# Altium schematic sheet vme_bus_buff.SchDoc
size A3
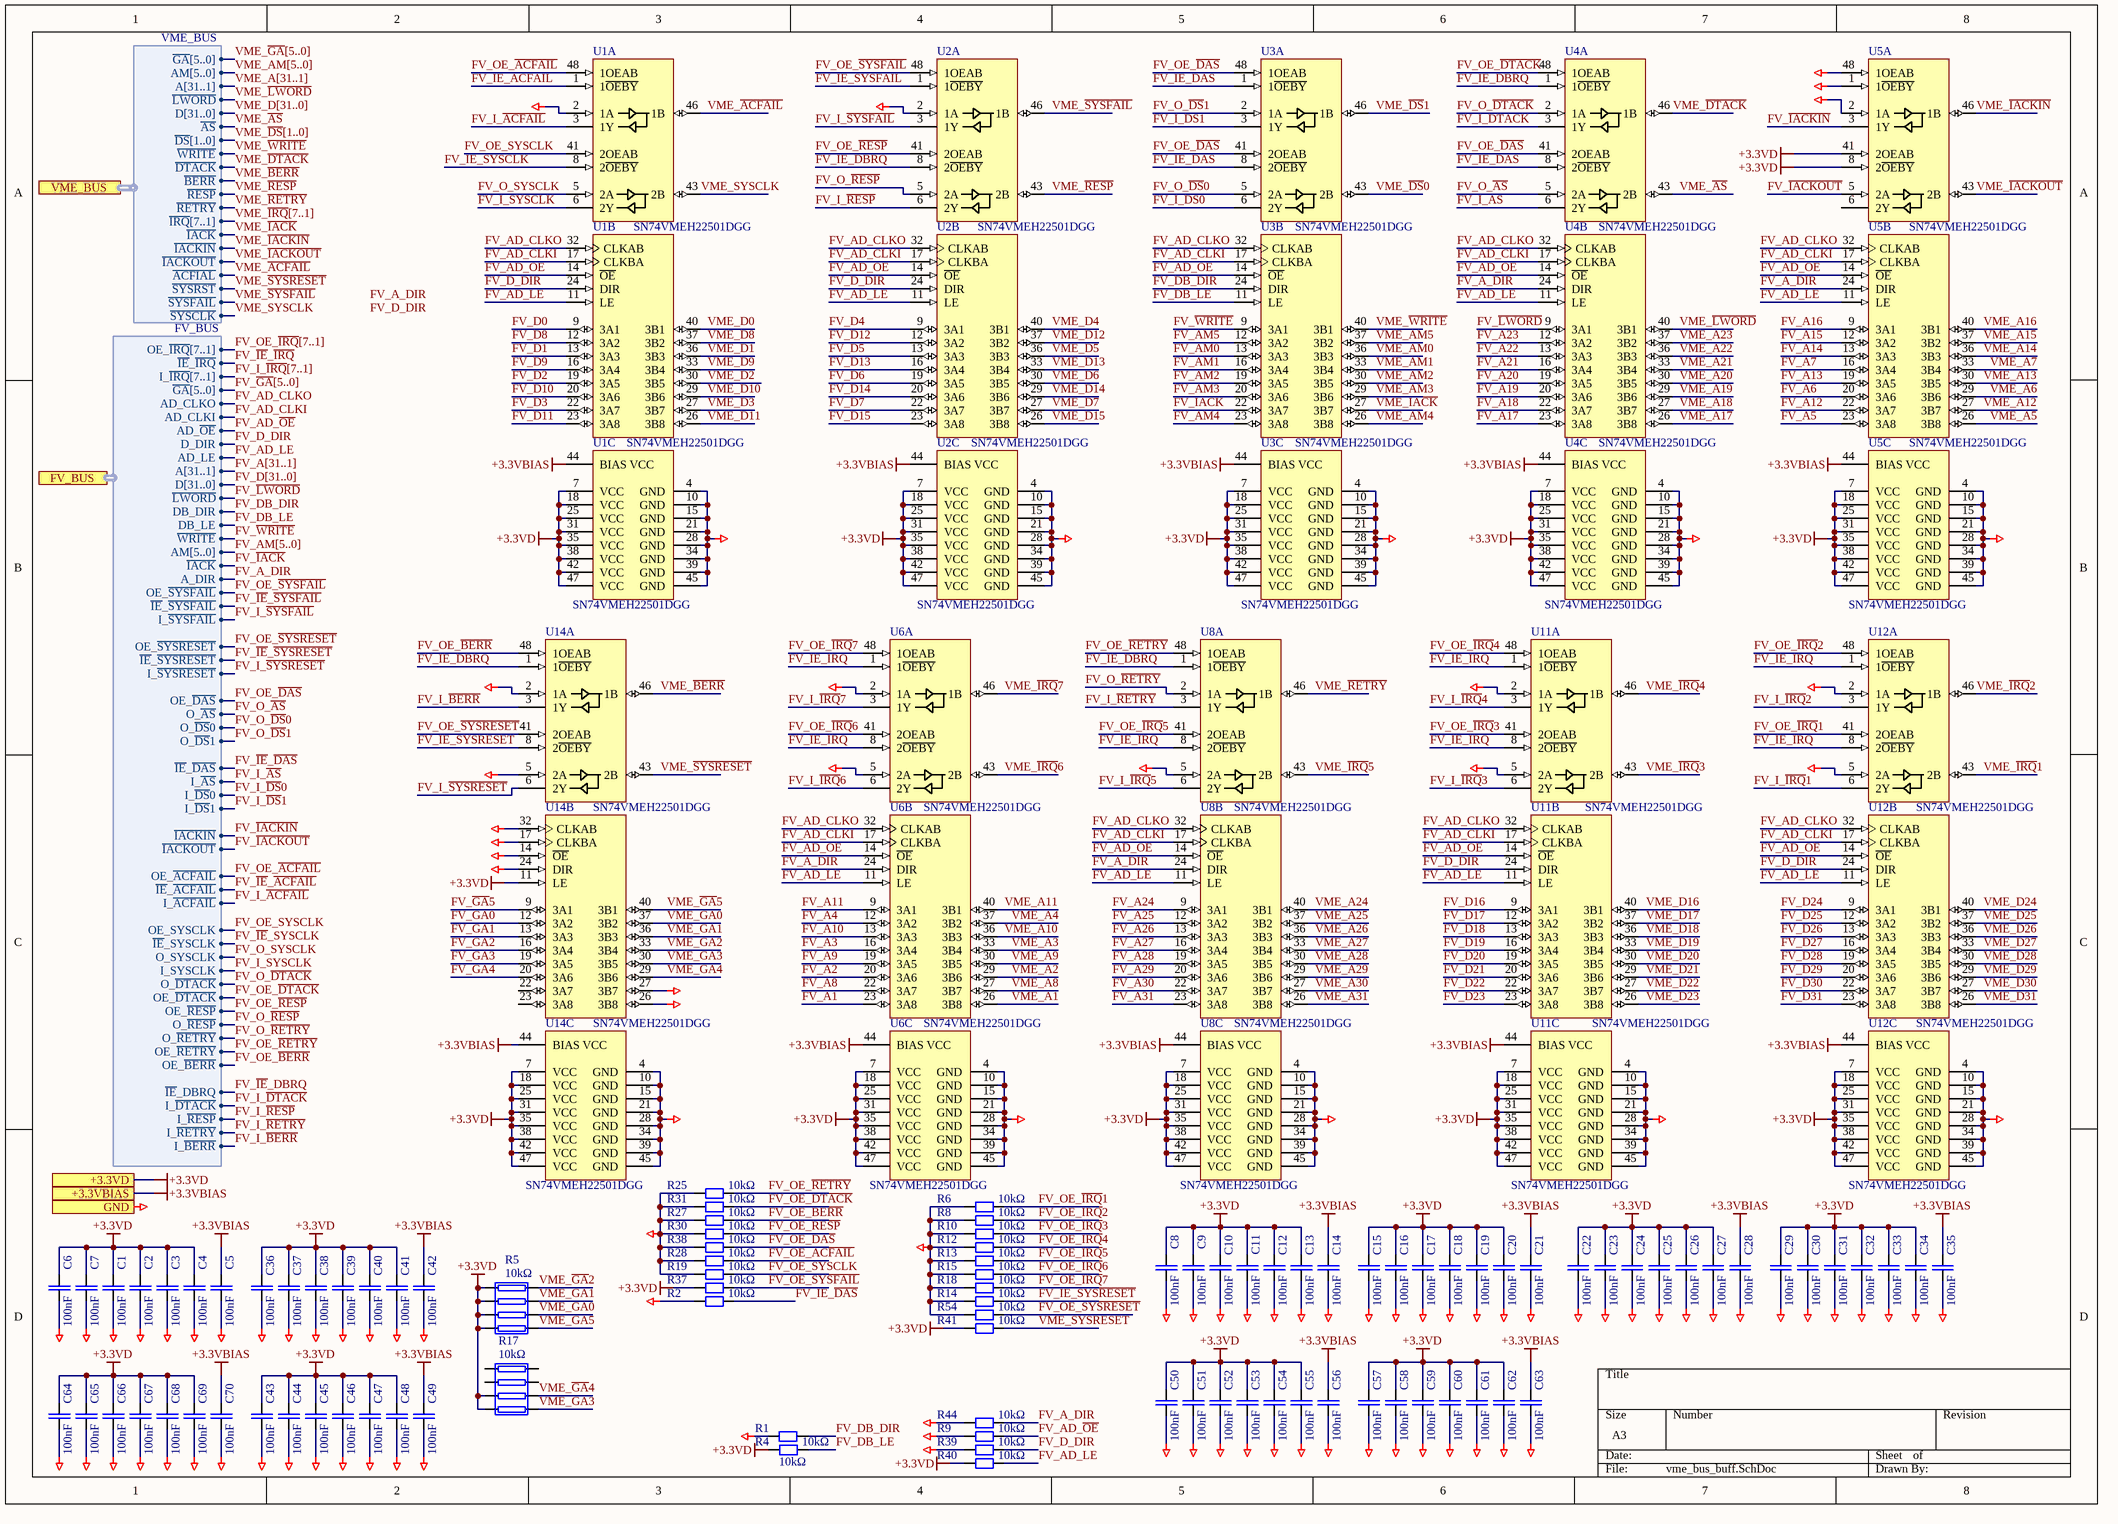
[diagram p0: vme_bus_buff.SchDoc]

## Parts
C1  100nF  [CAPC1608N]
C2  100nF  [CAPC1608N]
C3  100nF  [CAPC1608N]
C4  100nF  [CAPC1608N]
C5  100nF  [CAPC1608N]
C6  100nF  [CAPC1608N]
C7  100nF  [CAPC1608N]
C8  100nF  [CAPC1608N]
C9  100nF  [CAPC1608N]
C10  100nF  [CAPC1608N]
C11  100nF  [CAPC1608N]
C12  100nF  [CAPC1608N]
C13  100nF  [CAPC1608N]
C14  100nF  [CAPC1608N]
C15  100nF  [CAPC1608N]
C16  100nF  [CAPC1608N]
C17  100nF  [CAPC1608N]
C18  100nF  [CAPC1608N]
C19  100nF  [CAPC1608N]
C20  100nF  [CAPC1608N]
C21  100nF  [CAPC1608N]
C22  100nF  [CAPC1608N]
C23  100nF  [CAPC1608N]
C24  100nF  [CAPC1608N]
C25  100nF  [CAPC1608N]
C26  100nF  [CAPC1608N]
C27  100nF  [CAPC1608N]
C28  100nF  [CAPC1608N]
C29  100nF  [CAPC1608N]
C30  100nF  [CAPC1608N]
C31  100nF  [CAPC1608N]
C32  100nF  [CAPC1608N]
C33  100nF  [CAPC1608N]
C34  100nF  [CAPC1608N]
C35  100nF  [CAPC1608N]
C36  100nF  [CAPC1608N]
C37  100nF  [CAPC1608N]
C38  100nF  [CAPC1608N]
C39  100nF  [CAPC1608N]
C40  100nF  [CAPC1608N]
C41  100nF  [CAPC1608N]
C42  100nF  [CAPC1608N]
C43  100nF  [CAPC1608N]
C44  100nF  [CAPC1608N]
C45  100nF  [CAPC1608N]
C46  100nF  [CAPC1608N]
C47  100nF  [CAPC1608N]
C48  100nF  [CAPC1608N]
C49  100nF  [CAPC1608N]
C50  100nF  [CAPC1608N]
C51  100nF  [CAPC1608N]
C52  100nF  [CAPC1608N]
C53  100nF  [CAPC1608N]
C54  100nF  [CAPC1608N]
C55  100nF  [CAPC1608N]
C56  100nF  [CAPC1608N]
C57  100nF  [CAPC1608N]
C58  100nF  [CAPC1608N]
C59  100nF  [CAPC1608N]
C60  100nF  [CAPC1608N]
C61  100nF  [CAPC1608N]
C62  100nF  [CAPC1608N]
C63  100nF  [CAPC1608N]
C64  100nF  [CAPC1608N]
C65  100nF  [CAPC1608N]
C66  100nF  [CAPC1608N]
C67  100nF  [CAPC1608N]
C68  100nF  [CAPC1608N]
C69  100nF  [CAPC1608N]
C70  100nF  [CAPC1608N]
R1  10kΩ  [RESC2012N]
R2  10kΩ  [RESC2012N]
R4  10kΩ  [RESC2012N]
R5  value 10kΩ  [CAY16-J4]  (hidden comment: CAY16-1002F4LF)
R6  10kΩ  [RESC2012N]
R8  10kΩ  [RESC2012N]
R9  10kΩ  [RESC2012N]
R10  10kΩ  [RESC2012N]
R12  10kΩ  [RESC2012N]
R13  10kΩ  [RESC2012N]
R14  10kΩ  [RESC2012N]
R15  10kΩ  [RESC2012N]
R17  value 10kΩ  [CAY16-J4]  (hidden comment: CAY16-1002F4LF)
R18  10kΩ  [RESC2012N]
R19  10kΩ  [RESC2012N]
R25  10kΩ  [RESC2012N]
R27  10kΩ  [RESC2012N]
R28  10kΩ  [RESC2012N]
R30  10kΩ  [RESC2012N]
R31  10kΩ  [RESC2012N]
R37  10kΩ  [RESC2012N]
R38  10kΩ  [RESC2012N]
R39  10kΩ  [RESC2012N]
R40  10kΩ  [RESC2012N]
R41  10kΩ  [RESC2012N]
R44  10kΩ  [RESC2012N]
R54  10kΩ  [RESC2012N]
U1  SN74VMEH22501DGG  [DGG0048A_L]  (parts A,B,C of 3)
U2  SN74VMEH22501DGG  [DGG0048A_L]  (parts A,B,C of 3)
U3  SN74VMEH22501DGG  [DGG0048A_L]  (parts A,B,C of 3)
U4  SN74VMEH22501DGG  [DGG0048A_L]  (parts A,B,C of 3)
U5  SN74VMEH22501DGG  [DGG0048A_L]  (parts A,B,C of 3)
U6  SN74VMEH22501DGG  [DGG0048A_L]  (parts A,B,C of 3)
U8  SN74VMEH22501DGG  [DGG0048A_L]  (parts A,B,C of 3)
U11  SN74VMEH22501DGG  [DGG0048A_L]  (parts A,B,C of 3)
U12  SN74VMEH22501DGG  [DGG0048A_L]  (parts A,B,C of 3)
U14  SN74VMEH22501DGG  [DGG0048A_L]  (parts A,B,C of 3)

## Ports
+3.3VBIAS, +3.3VD, FV_BUS (harness FV_BUS), GND, VME_BUS (harness VME_BUS)

## Harnesses
VME_BUS: ~{GA}[5..0], AM[5..0], A[31..1], D[31..0], ~{AS}, ~{IACK}, ~{IACKIN}, ~{SYSFAIL}, ~{IRQ}[7..1], ~{IACKOUT}, ~{DTACK}, ~{DS}[1..0], ~{SYSRST}, ~{WRITE}, ~{LWORD}, ~{SYSCLK}, ~{BERR}, ~{RESP}, ~{RETRY}, ~{ACFIAL}
FV_BUS: OE_~{IRQ}[7..1], ~{IE}_~{IRQ}, AD_CLKI, I_~{IRQ}[7..1], DB_DIR, DB_LE, OE_~{SYSFAIL}, ~{WRITE}, AD_LE, AD_~{OE}, ~{IACK}, D_DIR, AD_CLKO, ~{IE}_~{SYSFAIL}, A[31..1], D[31..0], ~{LWORD}, AM[5..0], I_~{SYSFAIL}, OE_~{SYSRESET}, ~{IE}_~{SYSRESET}, I_~{SYSRESET}, ~{IE}_~{DAS}, O_~{DS}1, I_~{DS}1, OE_~{DAS}, O_~{AS}, I_~{AS}, ~{IACKIN}, ~{IACKOUT}, OE_~{ACFAIL}, ~{IE}_~{ACFAIL}, I_~{ACFAIL}, OE_SYSCLK, ~{IE}_SYSCLK, O_SYSCLK, I_SYSCLK, ~{IE}_DBRQ, OE_~{BERR}, I_~{BERR}, OE_~{RESP}, I_~{RESP}, OE_~{DTACK}, O_~{DTACK}, I_~{DTACK}, O_~{DS}0, I_~{DS}0, OE_~{RETRY}, I_~{RETRY}, ~{GA}[5..0], O_~{RESP}, O_~{RETRY}, A_DIR

## Nets
+3.3VBIAS: C5.2 C14.2 C21.2 C28.2 C35.2 C42.2 C49.2 C56.2 C63.2 C70.2 U1.44(BIAS_VCC) U2.44(BIAS_VCC) U3.44(BIAS_VCC) U4.44(BIAS_VCC) U5.44(BIAS_VCC) U6.44(BIAS_VCC) U8.44(BIAS_VCC) U11.44(BIAS_VCC) U12.44(BIAS_VCC) U14.44(BIAS_VCC) ; port +3.3VBIAS
+3.3VD: C1.2 C2.2 C3.2 C4.2 C6.2 C7.2 C8.2 C9.2 C10.2 C11.2 C12.2 C13.2 C15.2 C16.2 C17.2 C18.2 C19.2 C20.2 C22.2 C23.2 C24.2 C25.2 C26.2 C27.2 C29.2 C30.2 C31.2 C32.2 C33.2 C34.2 C36.2 C37.2 C38.2 C39.2 C40.2 C41.2 C43.2 C44.2 C45.2 C46.2 C47.2 C48.2 C50.2 C51.2 C52.2 C53.2 C54.2 C55.2 C57.2 C58.2 C59.2 C60.2 C61.2 C62.2 C64.2 C65.2 C66.2 C67.2 C68.2 C69.2 R4.1 R5.1 R5.2 R5.3 R5.4 R17.3 R17.4 R37.1 R40.1 R41.1 U1.7(VCC) U1.18(VCC) U1.25(VCC) U1.31(VCC) U1.35(VCC) U1.38(VCC) U1.42(VCC) U1.47(VCC) U2.7(VCC) U2.18(VCC) U2.25(VCC) U2.31(VCC) U2.35(VCC) U2.38(VCC) U2.42(VCC) U2.47(VCC) U3.7(VCC) U3.18(VCC) U3.25(VCC) U3.31(VCC) U3.35(VCC) U3.38(VCC) U3.42(VCC) U3.47(VCC) U4.7(VCC) U4.18(VCC) U4.25(VCC) U4.31(VCC) U4.35(VCC) U4.38(VCC) U4.42(VCC) U4.47(VCC) U5.7(VCC) U5.8(2~{OEBY}) U5.18(VCC) U5.25(VCC) U5.31(VCC) U5.35(VCC) U5.38(VCC) U5.41(2OEAB) U5.42(VCC) U5.47(VCC) U6.7(VCC) U6.18(VCC) U6.25(VCC) U6.31(VCC) U6.35(VCC) U6.38(VCC) U6.42(VCC) U6.47(VCC) U8.7(VCC) U8.18(VCC) U8.25(VCC) U8.31(VCC) U8.35(VCC) U8.38(VCC) U8.42(VCC) U8.47(VCC) U11.7(VCC) U11.18(VCC) U11.25(VCC) U11.31(VCC) U11.35(VCC) U11.38(VCC) U11.42(VCC) U11.47(VCC) U12.7(VCC) U12.18(VCC) U12.25(VCC) U12.31(VCC) U12.35(VCC) U12.38(VCC) U12.42(VCC) U12.47(VCC) U14.7(VCC) U14.11(LE) U14.18(VCC) U14.25(VCC) U14.31(VCC) U14.35(VCC) U14.38(VCC) U14.42(VCC) U14.47(VCC) ; port +3.3VD
GND: C1.1 C2.1 C3.1 C4.1 C5.1 C6.1 C7.1 C8.1 C9.1 C10.1 C11.1 C12.1 C13.1 C14.1 C15.1 C16.1 C17.1 C18.1 C19.1 C20.1 C21.1 C22.1 C23.1 C24.1 C25.1 C26.1 C27.1 C28.1 C29.1 C30.1 C31.1 C32.1 C33.1 C34.1 C35.1 C36.1 C37.1 C38.1 C39.1 C40.1 C41.1 C42.1 C43.1 C44.1 C45.1 C46.1 C47.1 C48.1 C49.1 C50.1 C51.1 C52.1 C53.1 C54.1 C55.1 C56.1 C57.1 C58.1 C59.1 C60.1 C61.1 C62.1 C63.1 C64.1 C65.1 C66.1 C67.1 C68.1 C69.1 C70.1 R1.2 R2.1 R6.1 R8.1 R9.1 R10.1 R12.1 R13.1 R14.1 R15.1 R18.1 R19.1 R25.1 R27.1 R28.1 R30.1 R31.1 R38.1 R39.1 R44.1 R54.1 U1.2(1A) U1.4(GND) U1.10(GND) U1.15(GND) U1.21(GND) U1.28(GND) U1.34(GND) U1.39(GND) U1.45(GND) U2.2(1A) U2.4(GND) U2.10(GND) U2.15(GND) U2.21(GND) U2.28(GND) U2.34(GND) U2.39(GND) U2.45(GND) U3.4(GND) U3.10(GND) U3.15(GND) U3.21(GND) U3.28(GND) U3.34(GND) U3.39(GND) U3.45(GND) U4.4(GND) U4.10(GND) U4.15(GND) U4.21(GND) U4.28(GND) U4.34(GND) U4.39(GND) U4.45(GND) U5.1(1~{OEBY}) U5.2(1A) U5.4(GND) U5.10(GND) U5.15(GND) U5.21(GND) U5.28(GND) U5.34(GND) U5.39(GND) U5.45(GND) U5.48(1OEAB) U6.2(1A) U6.4(GND) U6.5(2A) U6.10(GND) U6.15(GND) U6.21(GND) U6.28(GND) U6.34(GND) U6.39(GND) U6.45(GND) U8.4(GND) U8.5(2A) U8.10(GND) U8.15(GND) U8.21(GND) U8.28(GND) U8.34(GND) U8.39(GND) U8.45(GND) U11.2(1A) U11.4(GND) U11.5(2A) U11.10(GND) U11.15(GND) U11.21(GND) U11.28(GND) U11.34(GND) U11.39(GND) U11.45(GND) U12.2(1A) U12.4(GND) U12.5(2A) U12.10(GND) U12.15(GND) U12.21(GND) U12.28(GND) U12.34(GND) U12.39(GND) U12.45(GND) U14.2(1A) U14.4(GND) U14.5(2A) U14.10(GND) U14.14(~{OE}) U14.15(GND) U14.17(CLKBA) U14.21(GND) U14.24(DIR) U14.26(3B8) U14.27(3B7) U14.28(GND) U14.32(CLKAB) U14.34(GND) U14.39(GND) U14.45(GND) ; port GND
FV_A1: U6.23(3A8)
FV_A2: U6.20(3A6)
FV_A3: U6.16(3A4)
FV_A4: U6.12(3A2)
FV_A5: U5.23(3A8)
FV_A6: U5.20(3A6)
FV_A7: U5.16(3A4)
FV_A8: U6.22(3A7)
FV_A9: U6.19(3A5)
FV_A10: U6.13(3A3)
FV_A11: U6.9(3A1)
FV_A12: U5.22(3A7)
FV_A13: U5.19(3A5)
FV_A14: U5.13(3A3)
FV_A15: U5.12(3A2)
FV_A16: U5.9(3A1)
FV_A17: U4.23(3A8)
FV_A18: U4.22(3A7)
FV_A19: U4.20(3A6)
FV_A20: U4.19(3A5)
FV_A21: U4.16(3A4)
FV_A22: U4.13(3A3)
FV_A23: U4.12(3A2)
FV_A24: U8.9(3A1)
FV_A25: U8.12(3A2)
FV_A26: U8.13(3A3)
FV_A27: U8.16(3A4)
FV_A28: U8.19(3A5)
FV_A29: U8.20(3A6)
FV_A30: U8.22(3A7)
FV_A31: U8.23(3A8)
FV_A_DIR: R44.2 U4.24(DIR) U5.24(DIR) U6.24(DIR) U8.24(DIR) ; port FV_BUS.A_DIR
FV_AD_CLKI: U1.17(CLKBA) U2.17(CLKBA) U3.17(CLKBA) U4.17(CLKBA) U5.17(CLKBA) U6.17(CLKBA) U8.17(CLKBA) U11.17(CLKBA) U12.17(CLKBA) ; port FV_BUS.AD_CLKI
FV_AD_CLKO: U1.32(CLKAB) U2.32(CLKAB) U3.32(CLKAB) U4.32(CLKAB) U5.32(CLKAB) U6.32(CLKAB) U8.32(CLKAB) U11.32(CLKAB) U12.32(CLKAB) ; port FV_BUS.AD_CLKO
FV_AD_LE: R40.2 U1.11(LE) U2.11(LE) U4.11(LE) U5.11(LE) U6.11(LE) U8.11(LE) U11.11(LE) U12.11(LE) ; port FV_BUS.AD_LE
FV_AD_~{OE}: R9.2 U1.14(~{OE}) U2.14(~{OE}) U3.14(~{OE}) U4.14(~{OE}) U5.14(~{OE}) U6.14(~{OE}) U8.14(~{OE}) U11.14(~{OE}) U12.14(~{OE}) ; port FV_BUS.AD_~{OE}
FV_AM0: U3.13(3A3)
FV_AM1: U3.16(3A4)
FV_AM2: U3.19(3A5)
FV_AM3: U3.20(3A6)
FV_AM4: U3.23(3A8)
FV_AM5: U3.12(3A2)
FV_D0: U1.9(3A1)
FV_D1: U1.13(3A3)
FV_D2: U1.19(3A5)
FV_D3: U1.22(3A7)
FV_D4: U2.9(3A1)
FV_D5: U2.13(3A3)
FV_D6: U2.19(3A5)
FV_D7: U2.22(3A7)
FV_D8: U1.12(3A2)
FV_D9: U1.16(3A4)
FV_D10: U1.20(3A6)
FV_D11: U1.23(3A8)
FV_D12: U2.12(3A2)
FV_D13: U2.16(3A4)
FV_D14: U2.20(3A6)
FV_D15: U2.23(3A8)
FV_D16: U11.9(3A1)
FV_D17: U11.12(3A2)
FV_D18: U11.13(3A3)
FV_D19: U11.16(3A4)
FV_D20: U11.19(3A5)
FV_D21: U11.20(3A6)
FV_D22: U11.22(3A7)
FV_D23: U11.23(3A8)
FV_D24: U12.9(3A1)
FV_D25: U12.12(3A2)
FV_D26: U12.13(3A3)
FV_D27: U12.16(3A4)
FV_D28: U12.19(3A5)
FV_D29: U12.20(3A6)
FV_D30: U12.22(3A7)
FV_D31: U12.23(3A8)
FV_D_DIR: R39.2 U1.24(DIR) U2.24(DIR) U11.24(DIR) U12.24(DIR) ; port FV_BUS.D_DIR
FV_DB_DIR: R1.1 U3.24(DIR) ; port FV_BUS.DB_DIR
FV_DB_LE: R4.2 U3.11(LE) ; port FV_BUS.DB_LE
FV_~{GA}0: U14.12(3A2)
FV_~{GA}1: U14.13(3A3)
FV_~{GA}2: U14.16(3A4)
FV_~{GA}3: U14.19(3A5)
FV_~{GA}4: U14.20(3A6)
FV_~{GA}5: U14.9(3A1)
FV_~{IACK}: U3.22(3A7) ; port FV_BUS.~{IACK}
FV_~{IACKIN}: U5.3(1Y) ; port FV_BUS.~{IACKIN}
FV_~{IACKOUT}: U5.5(2A) ; port FV_BUS.~{IACKOUT}
FV_~{IE}_~{ACFAIL}: U1.1(1~{OEBY}) ; port FV_BUS.~{IE}_~{ACFAIL}
FV_~{IE}_~{DAS}: R2.2 U3.1(1~{OEBY}) U3.8(2~{OEBY}) U4.8(2~{OEBY}) ; port FV_BUS.~{IE}_~{DAS}
FV_~{IE}_DBRQ: U2.8(2~{OEBY}) U4.1(1~{OEBY}) U8.1(1~{OEBY}) U14.1(1~{OEBY}) ; port FV_BUS.~{IE}_DBRQ
FV_~{IE}_~{IRQ}: U6.1(1~{OEBY}) U6.8(2~{OEBY}) U8.8(2~{OEBY}) U11.1(1~{OEBY}) U11.8(2~{OEBY}) U12.1(1~{OEBY}) U12.8(2~{OEBY}) ; port FV_BUS.~{IE}_~{IRQ}
FV_~{IE}_~{SYSFAIL}: U2.1(1~{OEBY}) ; port FV_BUS.~{IE}_~{SYSFAIL}
FV_~{IE}_~{SYSRESET}: R14.2 U14.8(2~{OEBY}) ; port FV_BUS.~{IE}_~{SYSRESET}
FV_~{IE}_SYSCLK: U1.8(2~{OEBY}) ; port FV_BUS.~{IE}_SYSCLK
FV_I_~{ACFAIL}: U1.3(1Y) ; port FV_BUS.I_~{ACFAIL}
FV_I_~{AS}: U4.6(2Y) ; port FV_BUS.I_~{AS}
FV_I_~{BERR}: U14.3(1Y) ; port FV_BUS.I_~{BERR}
FV_I_~{DS}0: U3.6(2Y) ; port FV_BUS.I_~{DS}0
FV_I_~{DS}1: U3.3(1Y) ; port FV_BUS.I_~{DS}1
FV_I_~{DTACK}: U4.3(1Y) ; port FV_BUS.I_~{DTACK}
FV_I_~{IRQ}1: U12.6(2Y)
FV_I_~{IRQ}2: U12.3(1Y)
FV_I_~{IRQ}3: U11.6(2Y)
FV_I_~{IRQ}4: U11.3(1Y)
FV_I_~{IRQ}5: U8.6(2Y)
FV_I_~{IRQ}6: U6.6(2Y)
FV_I_~{IRQ}7: U6.3(1Y)
FV_I_~{RESP}: U2.6(2Y) ; port FV_BUS.I_~{RESP}
FV_I_~{RETRY}: U8.3(1Y) ; port FV_BUS.I_~{RETRY}
FV_I_~{SYSFAIL}: U2.3(1Y) ; port FV_BUS.I_~{SYSFAIL}
FV_I_~{SYSRESET}: U14.6(2Y) ; port FV_BUS.I_~{SYSRESET}
FV_I_SYSCLK: U1.6(2Y) ; port FV_BUS.I_SYSCLK
FV_~{LWORD}: U4.9(3A1) ; port FV_BUS.~{LWORD}
FV_O_~{AS}: U4.5(2A) ; port FV_BUS.O_~{AS}
FV_O_~{DS}0: U3.5(2A) ; port FV_BUS.O_~{DS}0
FV_O_~{DS}1: U3.2(1A) ; port FV_BUS.O_~{DS}1
FV_O_~{DTACK}: U4.2(1A) ; port FV_BUS.O_~{DTACK}
FV_O_~{RESP}: U2.5(2A) ; port FV_BUS.O_~{RESP}
FV_O_~{RETRY}: U8.2(1A) ; port FV_BUS.O_~{RETRY}
FV_O_SYSCLK: U1.5(2A) ; port FV_BUS.O_SYSCLK
FV_OE_~{ACFAIL}: R28.2 U1.48(1OEAB) ; port FV_BUS.OE_~{ACFAIL}
FV_OE_~{BERR}: R27.2 U14.48(1OEAB) ; port FV_BUS.OE_~{BERR}
FV_OE_~{DAS}: R38.2 U3.41(2OEAB) U3.48(1OEAB) U4.41(2OEAB) ; port FV_BUS.OE_~{DAS}
FV_OE_~{DTACK}: R31.2 U4.48(1OEAB) ; port FV_BUS.OE_~{DTACK}
FV_OE_~{IRQ}1: R6.2 U12.41(2OEAB)
FV_OE_~{IRQ}2: R8.2 U12.48(1OEAB)
FV_OE_~{IRQ}3: R10.2 U11.41(2OEAB)
FV_OE_~{IRQ}4: R12.2 U11.48(1OEAB)
FV_OE_~{IRQ}5: R13.2 U8.41(2OEAB)
FV_OE_~{IRQ}6: R15.2 U6.41(2OEAB)
FV_OE_~{IRQ}7: R18.2 U6.48(1OEAB)
FV_OE_~{RESP}: R30.2 U2.41(2OEAB) ; port FV_BUS.OE_~{RESP}
FV_OE_~{RETRY}: R25.2 U8.48(1OEAB) ; port FV_BUS.OE_~{RETRY}
FV_OE_~{SYSFAIL}: R37.2 U2.48(1OEAB) ; port FV_BUS.OE_~{SYSFAIL}
FV_OE_~{SYSRESET}: R54.2 U14.41(2OEAB) ; port FV_BUS.OE_~{SYSRESET}
FV_OE_SYSCLK: R19.2 U1.41(2OEAB) ; port FV_BUS.OE_SYSCLK
FV_~{WRITE}: U3.9(3A1) ; port FV_BUS.~{WRITE}
VME_A1: U6.26(3B8)
VME_A2: U6.29(3B6)
VME_A3: U6.33(3B4)
VME_A4: U6.37(3B2)
VME_A5: U5.26(3B8)
VME_A6: U5.29(3B6)
VME_A7: U5.33(3B4)
VME_A8: U6.27(3B7)
VME_A9: U6.30(3B5)
VME_A10: U6.36(3B3)
VME_A11: U6.40(3B1)
VME_A12: U5.27(3B7)
VME_A13: U5.30(3B5)
VME_A14: U5.36(3B3)
VME_A15: U5.37(3B2)
VME_A16: U5.40(3B1)
VME_A17: U4.26(3B8)
VME_A18: U4.27(3B7)
VME_A19: U4.29(3B6)
VME_A20: U4.30(3B5)
VME_A21: U4.33(3B4)
VME_A22: U4.36(3B3)
VME_A23: U4.37(3B2)
VME_A24: U8.40(3B1)
VME_A25: U8.37(3B2)
VME_A26: U8.36(3B3)
VME_A27: U8.33(3B4)
VME_A28: U8.30(3B5)
VME_A29: U8.29(3B6)
VME_A30: U8.27(3B7)
VME_A31: U8.26(3B8)
VME_~{ACFAIL}: U1.46(1B) ; port VME_BUS.~{ACFIAL}
VME_~{AS}: U4.43(2B) ; port VME_BUS.~{AS}
VME_AM0: U3.36(3B3)
VME_AM1: U3.33(3B4)
VME_AM2: U3.30(3B5)
VME_AM3: U3.29(3B6)
VME_AM4: U3.26(3B8)
VME_AM5: U3.37(3B2)
VME_~{BERR}: U14.46(1B) ; port VME_BUS.~{BERR}
VME_D0: U1.40(3B1)
VME_D1: U1.36(3B3)
VME_D2: U1.30(3B5)
VME_D3: U1.27(3B7)
VME_D4: U2.40(3B1)
VME_D5: U2.36(3B3)
VME_D6: U2.30(3B5)
VME_D7: U2.27(3B7)
VME_D8: U1.37(3B2)
VME_D9: U1.33(3B4)
VME_D10: U1.29(3B6)
VME_D11: U1.26(3B8)
VME_D12: U2.37(3B2)
VME_D13: U2.33(3B4)
VME_D14: U2.29(3B6)
VME_D15: U2.26(3B8)
VME_D16: U11.40(3B1)
VME_D17: U11.37(3B2)
VME_D18: U11.36(3B3)
VME_D19: U11.33(3B4)
VME_D20: U11.30(3B5)
VME_D21: U11.29(3B6)
VME_D22: U11.27(3B7)
VME_D23: U11.26(3B8)
VME_D24: U12.40(3B1)
VME_D25: U12.37(3B2)
VME_D26: U12.36(3B3)
VME_D27: U12.33(3B4)
VME_D28: U12.30(3B5)
VME_D29: U12.29(3B6)
VME_D30: U12.27(3B7)
VME_D31: U12.26(3B8)
VME_~{DS}0: U3.43(2B)
VME_~{DS}1: U3.46(1B)
VME_~{DTACK}: U4.46(1B) ; port VME_BUS.~{DTACK}
VME_~{GA}0: R5.6 U14.37(3B2)
VME_~{GA}1: R5.7 U14.36(3B3)
VME_~{GA}2: R5.8 U14.33(3B4)
VME_~{GA}3: R17.5 U14.30(3B5)
VME_~{GA}4: R17.6 U14.29(3B6)
VME_~{GA}5: R5.5 U14.40(3B1)
VME_~{IACK}: U3.27(3B7) ; port VME_BUS.~{IACK}
VME_~{IACKIN}: U5.46(1B) ; port VME_BUS.~{IACKIN}
VME_~{IACKOUT}: U5.43(2B) ; port VME_BUS.~{IACKOUT}
VME_~{IRQ}1: U12.43(2B)
VME_~{IRQ}2: U12.46(1B)
VME_~{IRQ}3: U11.43(2B)
VME_~{IRQ}4: U11.46(1B)
VME_~{IRQ}5: U8.43(2B)
VME_~{IRQ}6: U6.43(2B)
VME_~{IRQ}7: U6.46(1B)
VME_~{LWORD}: U4.40(3B1) ; port VME_BUS.~{LWORD}
VME_~{RESP}: U2.43(2B) ; port VME_BUS.~{RESP}
VME_~{RETRY}: U8.46(1B) ; port VME_BUS.~{RETRY}
VME_~{SYSFAIL}: U2.46(1B) ; port VME_BUS.~{SYSFAIL}
VME_~{SYSRESET}: R41.2 U14.43(2B) ; port VME_BUS.~{SYSRST}
VME_SYSCLK: U1.43(2B) ; port VME_BUS.~{SYSCLK}
VME_~{WRITE}: U3.40(3B1) ; port VME_BUS.~{WRITE}

Not connected (* = marked no-connect by the designer): R17 1 2 7 8; U5 6(2Y); U14 22(3A7) 23(3A8)

## Buses and harness runs
bus FV_A[31..1]
bus FV_AM[5..0]
bus FV_D[31..0]
bus FV_I_~{IRQ}[7..1]
bus FV_OE_~{IRQ}[7..1]
bus FV_~{GA}[5..0]
bus VME_A[31..1]
bus VME_AM[5..0]
bus VME_D[31..0]
bus VME_~{DS}[1..0]
bus VME_~{GA}[5..0]
bus VME_~{IRQ}[7..1]

## Notes on the sheet
- Labels drawn without touching a wire or pin: FV_A_DIR, FV_D_DIR

## Library data of the parts
C1-C70 = CAPC: Generic ceramic SMD capacitor; Pkg: 0603; Maintainer: Evgeniy Kotov; SMD Solders: 2; THD Solders: 0; PartField: 100nF; Last Change Data: 06.03.2017; Release Date: 06.03.2017; Value: 100nF
R1 R2 R4 R6 R8-R10 R12-R15 R18 R19 R25 R27 R28 R30 R31 R37-R41 R44 R54 = RESC: Resistor, Generic, SMD; Pkg: 0805; Maintainer: Evgeniy Kotov; SMD Solders: 2; THD Solders: 0; PartField: 10kΩ; Release Date: 06.03.2017; Last Change Data: 09.03.2017; Value: 10kΩ
R5 R17 = RESPACK4: Maintainer: Anton Pavlenko; Pkg: SMD 8pin; SMD Solders: 8; THD Solders: 0; PartField: CAY16-1002F4LF; Last Change Data: 16.05.2019; Release Date: 16.05.2019
U1-U6 U8 U11 U12 U14 = TI-SN74VMEH22501DGG: 8-Bit Universal Bus Transceiver and Two 1-Bit Bus Transceivers with 3-State Outputs, DGG, TUBE, 8.3mm; Manufacturer: Texas Instruments; Rating: Catalog; Logic: True; Input Type: LVTTL; Voltage(Nom)(V): 3.3; Schmitt Trigger: No; F @ Nom Voltage(Max)(Mhz): 120; VCC(Max)(V): 3.45; ICC @ Nom Voltage(Max)(mA): 30; VCC(Min)(V): 3.15; Bits(#): 10; Technology Family: VME; Output Drive (IOL/IOH)(Max)(mA): -12/12; tpd @ Nom Voltage(Max)(ns): 8.9; Pkg: TSSOP-48; SMD Solders: 48; THD Solders: 0; PackageReference: DGG0048A; Generic Part Number: SN74VMEH22501; ComponentLink2Description: Datasheet; ComponentLink1Description: Manufacturer URL; Operating Temperature Range(C): -40 to 85,0 to 85; ComponentLink1URL: http://www.ti.com/; DatasheetVersion: SCES357F; Output Type: LVTTL; Static Current: 30; PartNumber: SN74VMEH22501DGG; ComponentLink2URL: http://www.ti.com/lit/ds/symlink/sn74vmeh22501.pdf; PartField: SN74VMEH22501DGG; Value: SN74VMEH22501DGG